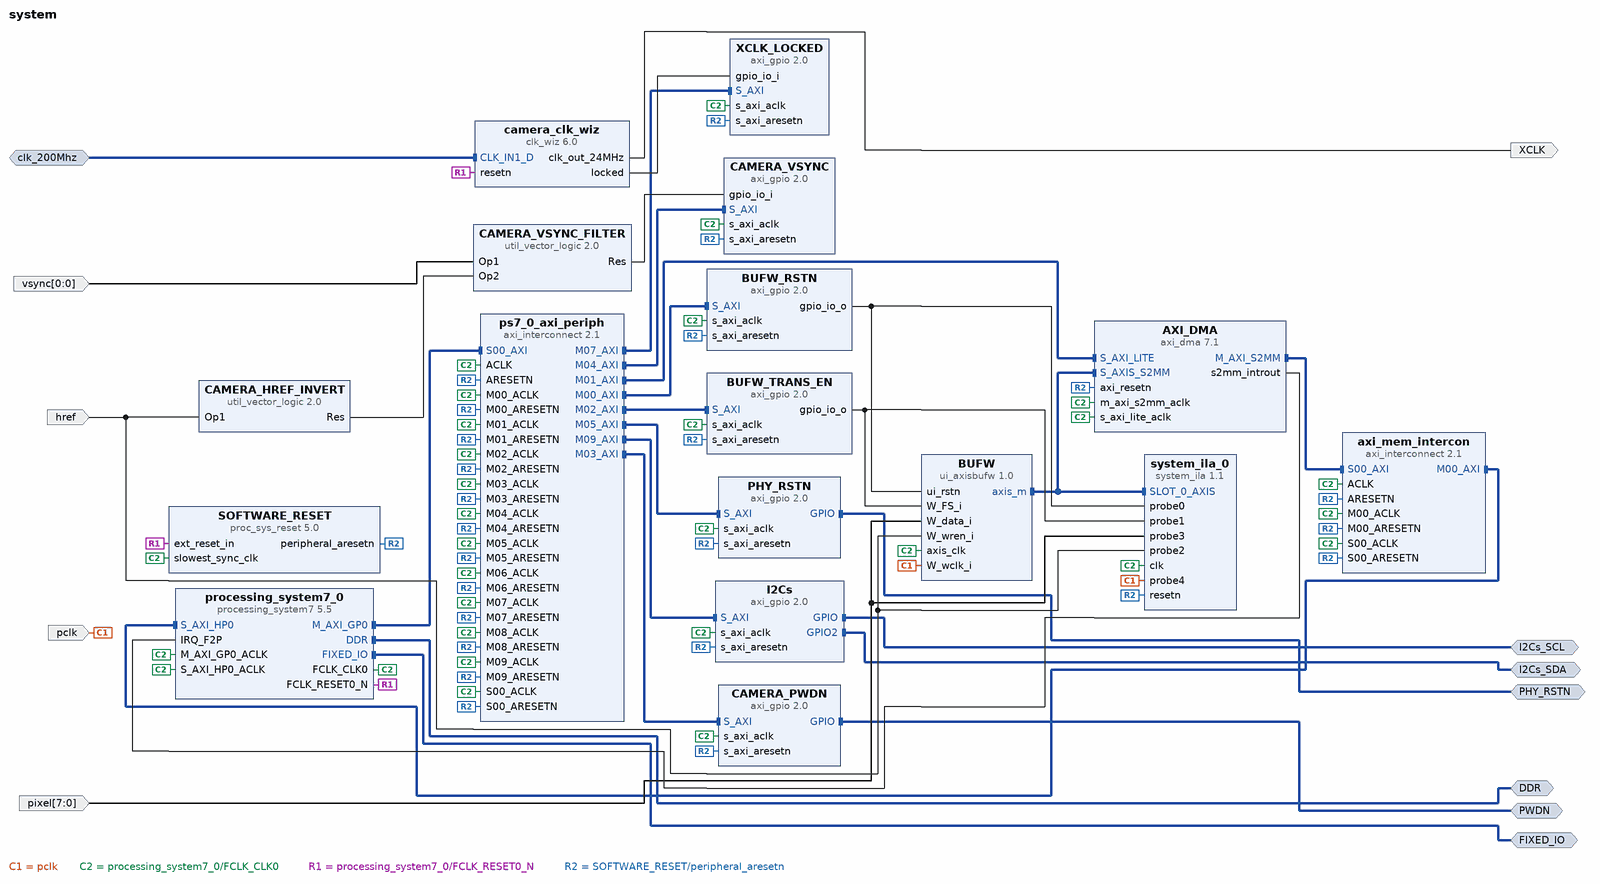
[diagram p0: block diagram of the top level]
# Vivado block design system, xc7z100ffg900-2, Vivado 2023.2
create_bd_design system

create_bd_intf_port -mode Master -vlnv xilinx.com:interface:ddrx_rtl:1.0 DDR
create_bd_intf_port -mode Master -vlnv xilinx.com:display_processing_system7:fixedio_rtl:1.0 FIXED_IO
create_bd_intf_port -mode Slave -vlnv xilinx.com:interface:diff_clock_rtl:1.0 clk_200Mhz
set_property -dict {CONFIG.FREQ_HZ 200000000} [get_bd_intf_ports clk_200Mhz]
create_bd_intf_port -mode Master -vlnv xilinx.com:interface:gpio_rtl:1.0 I2Cs_SCL
create_bd_intf_port -mode Master -vlnv xilinx.com:interface:gpio_rtl:1.0 I2Cs_SDA
create_bd_intf_port -mode Master -vlnv xilinx.com:interface:gpio_rtl:1.0 PWDN
create_bd_intf_port -mode Master -vlnv xilinx.com:interface:gpio_rtl:1.0 PHY_RSTN
create_bd_port -dir I pclk
create_bd_port -dir I href
create_bd_port -dir I -from 7 -to 0 pixel
create_bd_port -dir O -type clk XCLK
set_property -dict {CONFIG.FREQ_HZ 24000000} [get_bd_ports XCLK]
create_bd_port -dir I -from 0 -to 0 vsync

create_bd_cell -type ip -vlnv xilinx.com:ip:processing_system7:5.5 processing_system7_0
set_property -dict [list \
  CONFIG.PCW_APU_PERIPHERAL_FREQMHZ 666.666666 \
  CONFIG.PCW_CPU_CPU_6X4X_MAX_RANGE 800 \
  CONFIG.PCW_ENET0_ENET0_IO {MIO 16 .. 27} \
  CONFIG.PCW_ENET0_GRP_MDIO_ENABLE 1 \
  CONFIG.PCW_ENET0_GRP_MDIO_IO {MIO 52 .. 53} \
  CONFIG.PCW_ENET0_PERIPHERAL_ENABLE 1 \
  CONFIG.PCW_FPGA0_PERIPHERAL_FREQMHZ 100 \
  CONFIG.PCW_FPGA1_PERIPHERAL_FREQMHZ 24 \
  CONFIG.PCW_GPIO_MIO_GPIO_ENABLE 0 \
  CONFIG.PCW_I2C0_I2C0_IO EMIO \
  CONFIG.PCW_I2C0_PERIPHERAL_ENABLE 1 \
  CONFIG.PCW_I2C_PERIPHERAL_FREQMHZ 111.111115 \
  CONFIG.PCW_IRQ_F2P_INTR 1 \
  CONFIG.PCW_PERIPHERAL_BOARD_PRESET None \
  CONFIG.PCW_PRESET_BANK1_VOLTAGE {LVCMOS 1.8V} \
  CONFIG.PCW_QSPI_PERIPHERAL_ENABLE 0 \
  CONFIG.PCW_SD0_PERIPHERAL_ENABLE 0 \
  CONFIG.PCW_UART0_PERIPHERAL_ENABLE 1 \
  CONFIG.PCW_UART0_UART0_IO {MIO 46 .. 47} \
  CONFIG.PCW_UART1_PERIPHERAL_ENABLE 0 \
  CONFIG.PCW_UART_PERIPHERAL_FREQMHZ 100 \
  CONFIG.PCW_UIPARAM_DDR_FREQ_MHZ 533.333333 \
  CONFIG.PCW_UIPARAM_DDR_PARTNO {MT41K256M16 RE-125} \
  CONFIG.PCW_USB0_PERIPHERAL_ENABLE 0 \
  CONFIG.PCW_USE_FABRIC_INTERRUPT 1 \
  CONFIG.PCW_USE_S_AXI_HP0 1 \
  CONFIG.preset None \
] [get_bd_cells processing_system7_0]
# 391 more settings of processing_system7_0 are not shown: defaults, MIO pin electricals, DDR timing, and values the tool derives
create_bd_cell -type ip -vlnv xilinx.com:ip:axi_interconnect:2.1 ps7_0_axi_periph
set_property -dict {CONFIG.NUM_MI 10} [get_bd_cells ps7_0_axi_periph]
create_bd_cell -type ip -vlnv xilinx.com:ip:proc_sys_reset:5.0 SOFTWARE_RESET
create_bd_cell -type ip -vlnv xilinx.com:ip:axi_dma:7.1 AXI_DMA
set_property -dict [list \
  CONFIG.c_addr_width 32 \
  CONFIG.c_include_mm2s 0 \
  CONFIG.c_include_sg 0 \
  CONFIG.c_s2mm_burst_size 16 \
  CONFIG.c_sg_length_width 20 \
] [get_bd_cells AXI_DMA]
create_bd_cell -type ip -vlnv xilinx.com:ip:clk_wiz:6.0 camera_clk_wiz
set_property -dict [list \
  CONFIG.CLKIN1_JITTER_PS 50.0 \
  CONFIG.CLKIN2_JITTER_PS 166.66 \
  CONFIG.CLKOUT1_JITTER 228.662 \
  CONFIG.CLKOUT1_PHASE_ERROR 190.896 \
  CONFIG.CLKOUT1_REQUESTED_OUT_FREQ 24.000 \
  CONFIG.CLK_OUT1_PORT clk_out_24MHz \
  CONFIG.MMCM_CLKFBOUT_MULT_F 25.125 \
  CONFIG.MMCM_CLKIN1_PERIOD 5.000 \
  CONFIG.MMCM_CLKIN2_PERIOD 10.0 \
  CONFIG.MMCM_CLKOUT0_DIVIDE_F 41.875 \
  CONFIG.MMCM_DIVCLK_DIVIDE 5 \
  CONFIG.PRIM_IN_FREQ 200.000 \
  CONFIG.PRIM_SOURCE Differential_clock_capable_pin \
  CONFIG.RESET_PORT resetn \
  CONFIG.RESET_TYPE ACTIVE_LOW \
  CONFIG.SECONDARY_SOURCE Single_ended_clock_capable_pin \
  CONFIG.USE_INCLK_SWITCHOVER false \
  CONFIG.USE_LOCKED true \
  CONFIG.USE_RESET true \
] [get_bd_cells camera_clk_wiz]
create_bd_cell -type ip -vlnv xilinx.com:ip:axi_gpio:2.0 I2Cs
set_property -dict [list \
  CONFIG.C_ALL_OUTPUTS 1 \
  CONFIG.C_DOUT_DEFAULT 0x00000001 \
  CONFIG.C_DOUT_DEFAULT_2 0x00000001 \
  CONFIG.C_GPIO2_WIDTH 1 \
  CONFIG.C_GPIO_WIDTH 1 \
  CONFIG.C_IS_DUAL 1 \
] [get_bd_cells I2Cs]
create_bd_cell -type ip -vlnv xilinx.com:ip:axi_gpio:2.0 BUFW_RSTN
set_property -dict {CONFIG.C_ALL_OUTPUTS 1 CONFIG.C_GPIO_WIDTH 1} [get_bd_cells BUFW_RSTN]
create_bd_cell -type ip -vlnv xilinx.com:user:ui_axisbufw:1.0 BUFW
set_property -dict [list \
  CONFIG.AXI_DATA_WIDTH 32 \
  CONFIG.VIDEO_ENABLE false \
  CONFIG.W_BUFDEPTH 2048 \
  CONFIG.W_DATAWIDTH 8 \
  CONFIG.W_XSIZE 640 \
  CONFIG.W_YSIZE 480 \
] [get_bd_cells BUFW]
create_bd_cell -type ip -vlnv xilinx.com:ip:util_vector_logic:2.0 CAMERA_HREF_INVERT
set_property -dict {CONFIG.C_OPERATION not CONFIG.C_SIZE 1} [get_bd_cells CAMERA_HREF_INVERT]
create_bd_cell -type ip -vlnv xilinx.com:ip:util_vector_logic:2.0 CAMERA_VSYNC_FILTER
set_property -dict {CONFIG.C_SIZE 1} [get_bd_cells CAMERA_VSYNC_FILTER]
create_bd_cell -type ip -vlnv xilinx.com:ip:axi_gpio:2.0 XCLK_LOCKED
set_property -dict {CONFIG.C_ALL_INPUTS 1 CONFIG.C_GPIO_WIDTH 1} [get_bd_cells XCLK_LOCKED]
create_bd_cell -type ip -vlnv xilinx.com:ip:axi_gpio:2.0 BUFW_TRANS_EN
set_property -dict {CONFIG.C_ALL_OUTPUTS 1 CONFIG.C_GPIO_WIDTH 1} [get_bd_cells BUFW_TRANS_EN]
create_bd_cell -type ip -vlnv xilinx.com:ip:axi_gpio:2.0 CAMERA_VSYNC
set_property -dict {CONFIG.C_ALL_INPUTS 1 CONFIG.C_GPIO_WIDTH 1} [get_bd_cells CAMERA_VSYNC]
create_bd_cell -type ip -vlnv xilinx.com:ip:axi_gpio:2.0 PHY_RSTN
set_property -dict {CONFIG.C_ALL_OUTPUTS 1 CONFIG.C_GPIO_WIDTH 1} [get_bd_cells PHY_RSTN]
create_bd_cell -type ip -vlnv xilinx.com:ip:axi_gpio:2.0 CAMERA_PWDN
set_property -dict {CONFIG.C_ALL_OUTPUTS 1 CONFIG.C_DOUT_DEFAULT 0x00000001 CONFIG.C_GPIO_WIDTH 1} [get_bd_cells CAMERA_PWDN]
create_bd_cell -type ip -vlnv xilinx.com:ip:axi_interconnect:2.1 axi_mem_intercon
set_property -dict {CONFIG.NUM_MI 1} [get_bd_cells axi_mem_intercon]
create_bd_cell -type ip -vlnv xilinx.com:ip:system_ila:1.1 system_ila_0
set_property -dict [list \
  CONFIG.C_DATA_DEPTH 2048 \
  CONFIG.C_MON_TYPE MIX \
  CONFIG.C_NUM_MONITOR_SLOTS 1 \
  CONFIG.C_NUM_OF_PROBES 5 \
  CONFIG.C_PROBE0_TYPE 0 \
  CONFIG.C_PROBE1_TYPE 0 \
  CONFIG.C_PROBE2_TYPE 0 \
  CONFIG.C_PROBE3_TYPE 0 \
  CONFIG.C_PROBE4_TYPE 0 \
  CONFIG.C_SLOT_0_APC_EN 0 \
  CONFIG.C_SLOT_0_AXI_DATA_SEL 1 \
  CONFIG.C_SLOT_0_AXI_TRIG_SEL 1 \
  CONFIG.C_SLOT_0_INTF_TYPE xilinx.com:interface:axis_rtl:1.0 \
] [get_bd_cells system_ila_0]

# ---- connections ----

connect_bd_intf_net [get_bd_intf_pins AXI_DMA/M_AXI_S2MM] [get_bd_intf_pins axi_mem_intercon/S00_AXI]
connect_bd_intf_net [get_bd_intf_ports PWDN] [get_bd_intf_pins CAMERA_PWDN/GPIO]
connect_bd_intf_net [get_bd_intf_ports PHY_RSTN] [get_bd_intf_pins PHY_RSTN/GPIO]
connect_bd_intf_net -intf_net axi_gpio_0_GPIO [get_bd_intf_ports I2Cs_SCL] [get_bd_intf_pins I2Cs/GPIO]
connect_bd_intf_net -intf_net axi_gpio_0_GPIO2 [get_bd_intf_ports I2Cs_SDA] [get_bd_intf_pins I2Cs/GPIO2]
connect_bd_intf_net [get_bd_intf_pins axi_mem_intercon/M00_AXI] [get_bd_intf_pins processing_system7_0/S_AXI_HP0]
connect_bd_intf_net -intf_net diff_clock_rtl_0_1 [get_bd_intf_ports clk_200Mhz] [get_bd_intf_pins camera_clk_wiz/CLK_IN1_D]
connect_bd_intf_net [get_bd_intf_ports DDR] [get_bd_intf_pins processing_system7_0/DDR]
connect_bd_intf_net [get_bd_intf_ports FIXED_IO] [get_bd_intf_pins processing_system7_0/FIXED_IO]
connect_bd_intf_net [get_bd_intf_pins processing_system7_0/M_AXI_GP0] [get_bd_intf_pins ps7_0_axi_periph/S00_AXI]
connect_bd_intf_net [get_bd_intf_pins ps7_0_axi_periph/M00_AXI] [get_bd_intf_pins BUFW_RSTN/S_AXI]
connect_bd_intf_net [get_bd_intf_pins ps7_0_axi_periph/M01_AXI] [get_bd_intf_pins AXI_DMA/S_AXI_LITE]
connect_bd_intf_net [get_bd_intf_pins ps7_0_axi_periph/M02_AXI] [get_bd_intf_pins BUFW_TRANS_EN/S_AXI]
connect_bd_intf_net [get_bd_intf_pins ps7_0_axi_periph/M03_AXI] [get_bd_intf_pins CAMERA_PWDN/S_AXI]
connect_bd_intf_net [get_bd_intf_pins ps7_0_axi_periph/M04_AXI] [get_bd_intf_pins CAMERA_VSYNC/S_AXI]
connect_bd_intf_net [get_bd_intf_pins ps7_0_axi_periph/M05_AXI] [get_bd_intf_pins PHY_RSTN/S_AXI]
connect_bd_intf_net [get_bd_intf_pins ps7_0_axi_periph/M07_AXI] [get_bd_intf_pins XCLK_LOCKED/S_AXI]
connect_bd_intf_net [get_bd_intf_pins ps7_0_axi_periph/M09_AXI] [get_bd_intf_pins I2Cs/S_AXI]
connect_bd_intf_net -intf_net ui_axisbufw_0_axis_m [get_bd_intf_pins BUFW/axis_m] [get_bd_intf_pins AXI_DMA/S_AXIS_S2MM]
connect_bd_intf_net [get_bd_intf_pins BUFW/axis_m] [get_bd_intf_pins system_ila_0/SLOT_0_AXIS]
connect_bd_net -net BUFW_RSTN_gpio_io_o [get_bd_pins BUFW_RSTN/gpio_io_o] [get_bd_pins BUFW/ui_rstn] [get_bd_pins system_ila_0/probe0]
connect_bd_net -net BUFW_TRANS_EN_gpio_io_o [get_bd_pins BUFW_TRANS_EN/gpio_io_o] [get_bd_pins BUFW/W_FS_i] [get_bd_pins system_ila_0/probe1]
connect_bd_net -net W_data_i_0_1 [get_bd_ports pixel] [get_bd_pins BUFW/W_data_i] [get_bd_pins system_ila_0/probe3]
connect_bd_net -net W_wclk_i_0_1 [get_bd_ports pclk] [get_bd_pins BUFW/W_wclk_i] [get_bd_pins system_ila_0/probe4]
connect_bd_net -net axi_dma_0_s2mm_introut [get_bd_pins AXI_DMA/s2mm_introut] [get_bd_pins processing_system7_0/IRQ_F2P]
connect_bd_net [get_bd_pins camera_clk_wiz/locked] [get_bd_pins XCLK_LOCKED/gpio_io_i]
connect_bd_net -net clk_wiz_0_clk_out_24MHz [get_bd_pins camera_clk_wiz/clk_out_24MHz] [get_bd_ports XCLK]
connect_bd_net -net i_href_1 [get_bd_ports href] [get_bd_pins BUFW/W_wren_i] [get_bd_pins system_ila_0/probe2] [get_bd_pins CAMERA_HREF_INVERT/Op1]
connect_bd_net [get_bd_pins processing_system7_0/FCLK_CLK0] \
  [get_bd_pins processing_system7_0/M_AXI_GP0_ACLK] [get_bd_pins processing_system7_0/S_AXI_HP0_ACLK] \
  [get_bd_pins BUFW/axis_clk] [get_bd_pins AXI_DMA/s_axi_lite_aclk] [get_bd_pins AXI_DMA/m_axi_s2mm_aclk] \
  [get_bd_pins I2Cs/s_axi_aclk] [get_bd_pins BUFW_RSTN/s_axi_aclk] [get_bd_pins XCLK_LOCKED/s_axi_aclk] \
  [get_bd_pins BUFW_TRANS_EN/s_axi_aclk] [get_bd_pins CAMERA_VSYNC/s_axi_aclk] [get_bd_pins PHY_RSTN/s_axi_aclk] \
  [get_bd_pins CAMERA_PWDN/s_axi_aclk] [get_bd_pins axi_mem_intercon/ACLK] [get_bd_pins axi_mem_intercon/S00_ACLK] \
  [get_bd_pins axi_mem_intercon/M00_ACLK] [get_bd_pins ps7_0_axi_periph/ACLK] [get_bd_pins ps7_0_axi_periph/S00_ACLK] \
  [get_bd_pins ps7_0_axi_periph/M00_ACLK] [get_bd_pins ps7_0_axi_periph/M01_ACLK] [get_bd_pins ps7_0_axi_periph/M02_ACLK] \
  [get_bd_pins ps7_0_axi_periph/M03_ACLK] [get_bd_pins ps7_0_axi_periph/M04_ACLK] [get_bd_pins ps7_0_axi_periph/M05_ACLK] \
  [get_bd_pins ps7_0_axi_periph/M06_ACLK] [get_bd_pins ps7_0_axi_periph/M07_ACLK] [get_bd_pins ps7_0_axi_periph/M08_ACLK] \
  [get_bd_pins ps7_0_axi_periph/M09_ACLK] [get_bd_pins SOFTWARE_RESET/slowest_sync_clk] [get_bd_pins system_ila_0/clk]
connect_bd_net [get_bd_pins processing_system7_0/FCLK_RESET0_N] [get_bd_pins camera_clk_wiz/resetn] [get_bd_pins SOFTWARE_RESET/ext_reset_in]
connect_bd_net -net rst_ps7_0_50M_peripheral_aresetn [get_bd_pins SOFTWARE_RESET/peripheral_aresetn] \
  [get_bd_pins AXI_DMA/axi_resetn] [get_bd_pins I2Cs/s_axi_aresetn] [get_bd_pins BUFW_RSTN/s_axi_aresetn] \
  [get_bd_pins XCLK_LOCKED/s_axi_aresetn] [get_bd_pins BUFW_TRANS_EN/s_axi_aresetn] [get_bd_pins CAMERA_VSYNC/s_axi_aresetn] \
  [get_bd_pins PHY_RSTN/s_axi_aresetn] [get_bd_pins CAMERA_PWDN/s_axi_aresetn] [get_bd_pins axi_mem_intercon/ARESETN] \
  [get_bd_pins axi_mem_intercon/S00_ARESETN] [get_bd_pins axi_mem_intercon/M00_ARESETN] \
  [get_bd_pins ps7_0_axi_periph/ARESETN] [get_bd_pins ps7_0_axi_periph/S00_ARESETN] \
  [get_bd_pins ps7_0_axi_periph/M00_ARESETN] [get_bd_pins ps7_0_axi_periph/M01_ARESETN] \
  [get_bd_pins ps7_0_axi_periph/M02_ARESETN] [get_bd_pins ps7_0_axi_periph/M03_ARESETN] \
  [get_bd_pins ps7_0_axi_periph/M04_ARESETN] [get_bd_pins ps7_0_axi_periph/M05_ARESETN] \
  [get_bd_pins ps7_0_axi_periph/M06_ARESETN] [get_bd_pins ps7_0_axi_periph/M07_ARESETN] \
  [get_bd_pins ps7_0_axi_periph/M08_ARESETN] [get_bd_pins ps7_0_axi_periph/M09_ARESETN] [get_bd_pins system_ila_0/resetn]
connect_bd_net -net util_vector_logic_0_Res [get_bd_pins CAMERA_HREF_INVERT/Res] [get_bd_pins CAMERA_VSYNC_FILTER/Op2]
connect_bd_net -net util_vector_logic_1_Res [get_bd_pins CAMERA_VSYNC_FILTER/Res] [get_bd_pins CAMERA_VSYNC/gpio_io_i]
connect_bd_net [get_bd_ports vsync] [get_bd_pins CAMERA_VSYNC_FILTER/Op1]
set_property HDL_ATTRIBUTE.DEBUG true [get_bd_intf_nets ui_axisbufw_0_axis_m]
set_property HDL_ATTRIBUTE.MARK_DEBUG true [get_bd_intf_nets ui_axisbufw_0_axis_m]
set_property HDL_ATTRIBUTE.DEBUG true [get_bd_nets BUFW_RSTN_gpio_io_o]
set_property HDL_ATTRIBUTE.MARK_DEBUG true [get_bd_nets BUFW_RSTN_gpio_io_o]
set_property HDL_ATTRIBUTE.DEBUG true [get_bd_nets BUFW_TRANS_EN_gpio_io_o]
set_property HDL_ATTRIBUTE.MARK_DEBUG true [get_bd_nets BUFW_TRANS_EN_gpio_io_o]
set_property HDL_ATTRIBUTE.DEBUG true [get_bd_nets W_data_i_0_1]
set_property HDL_ATTRIBUTE.MARK_DEBUG true [get_bd_nets W_data_i_0_1]
set_property HDL_ATTRIBUTE.DEBUG true [get_bd_nets W_wclk_i_0_1]
set_property HDL_ATTRIBUTE.MARK_DEBUG true [get_bd_nets W_wclk_i_0_1]
set_property HDL_ATTRIBUTE.DEBUG true [get_bd_nets i_href_1]
set_property HDL_ATTRIBUTE.MARK_DEBUG true [get_bd_nets i_href_1]

# ---- address map ----
assign_bd_address -offset 0x00000000 -range 1G -target_address_space [get_bd_addr_spaces AXI_DMA/Data_S2MM] [get_bd_addr_segs processing_system7_0/S_AXI_HP0/HP0_DDR_LOWOCM]
assign_bd_address -offset 0x40400000 -range 64K -target_address_space [get_bd_addr_spaces processing_system7_0/Data] [get_bd_addr_segs AXI_DMA/S_AXI_LITE/Reg]
assign_bd_address -offset 0x41200000 -range 64K -target_address_space [get_bd_addr_spaces processing_system7_0/Data] [get_bd_addr_segs BUFW_TRANS_EN/S_AXI/Reg]
assign_bd_address -offset 0x41210000 -range 64K -target_address_space [get_bd_addr_spaces processing_system7_0/Data] [get_bd_addr_segs CAMERA_PWDN/S_AXI/Reg]
assign_bd_address -offset 0x41220000 -range 64K -target_address_space [get_bd_addr_spaces processing_system7_0/Data] [get_bd_addr_segs CAMERA_VSYNC/S_AXI/Reg]
assign_bd_address -offset 0x41230000 -range 64K -target_address_space [get_bd_addr_spaces processing_system7_0/Data] [get_bd_addr_segs PHY_RSTN/S_AXI/Reg]
assign_bd_address -offset 0x41250000 -range 64K -target_address_space [get_bd_addr_spaces processing_system7_0/Data] [get_bd_addr_segs XCLK_LOCKED/S_AXI/Reg]
assign_bd_address -offset 0x41270000 -range 64K -target_address_space [get_bd_addr_spaces processing_system7_0/Data] [get_bd_addr_segs BUFW_RSTN/S_AXI/Reg]
assign_bd_address -offset 0x41280000 -range 64K -target_address_space [get_bd_addr_spaces processing_system7_0/Data] [get_bd_addr_segs I2Cs/S_AXI/Reg]

validate_bd_design
save_bd_design
